# EAGLE design highSpeed_SoC_RS485 (EAGLE 9.6.2)
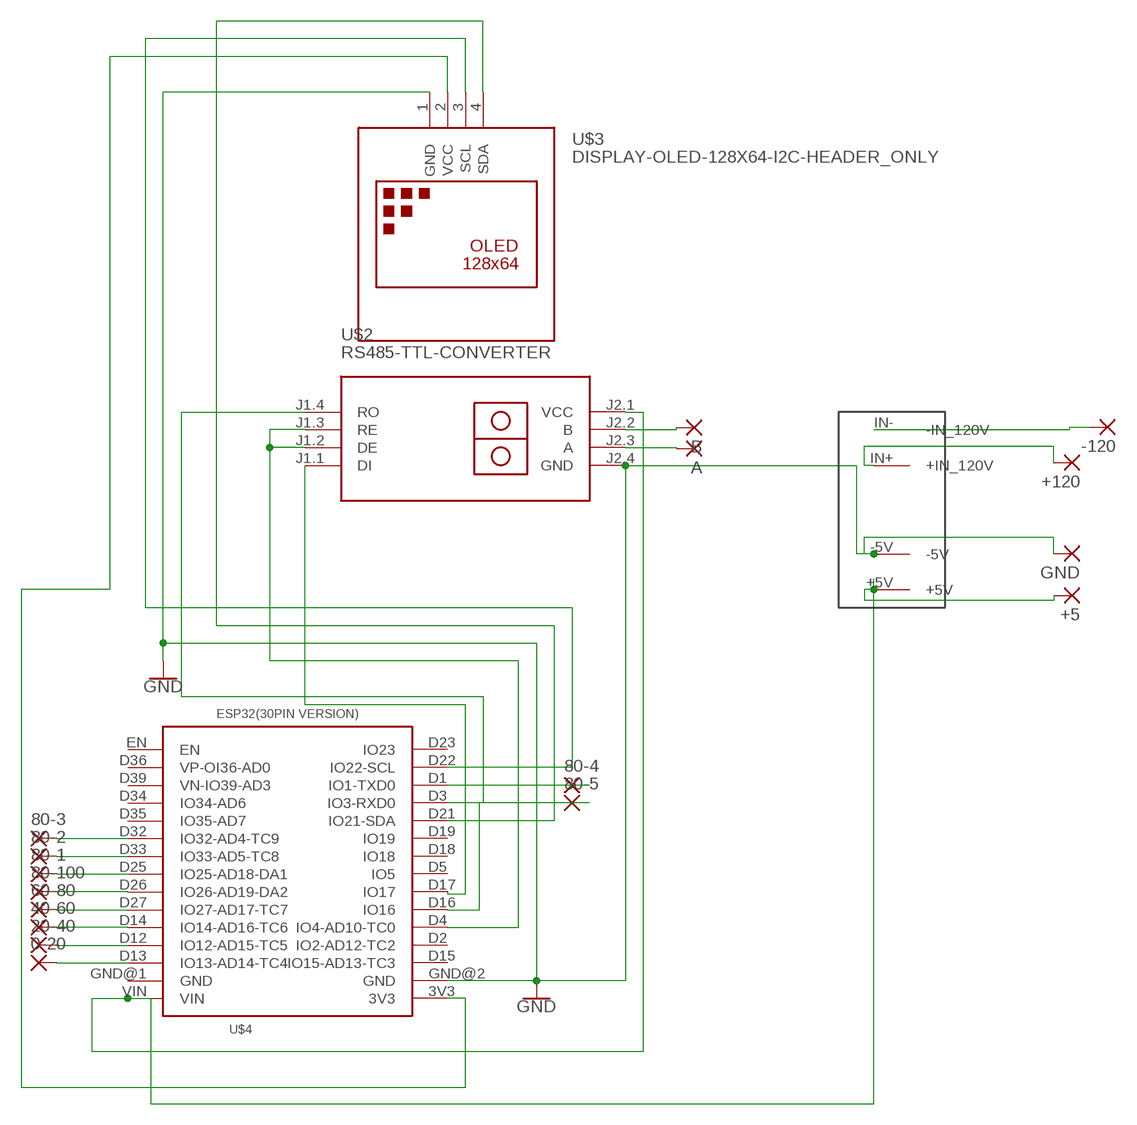
[diagram p0: schematic, sheet 1]

## Parts
0-20  2,54/1,0  [2,54/1,0]
20-40  2,54/1,0  [2,54/1,0]
40-60  2,54/1,0  [2,54/1,0]
60-80  2,54/1,0  [2,54/1,0]
80-1  2,54/1,0  [2,54/1,0]
80-2  2,54/1,0  [2,54/1,0]
80-3  2,54/1,0  [2,54/1,0]
80-4  2,54/1,0  [2,54/1,0]
80-5  2,54/1,0  [2,54/1,0]
80-100  2,54/1,0  [2,54/1,0]
+5  2,54/1,0  [2,54/1,0]
+120  2,54/1,0  [2,54/1,0]
-120  2,54/1,0  [2,54/1,0]
A  2,54/1,0  [2,54/1,0]
B  2,54/1,0  [2,54/1,0]
GND  2,54/1,0  [2,54/1,0]
U$1  DC-DC_CONVERTER_WOLF1  [DC-DC_CONVERTER_WOLF1]
U$2  RS485-TTL-CONVERTER  [RS485-TTL-CONVERTER]
U$3  DISPLAY-OLED-128X64-I2C-HEADER_ONLY  [DISPLAY-OLED-128X64-I2C-HEADER_ONLY]
U$4  ESP32(30PIN_VERSION)  [ESP32(30PIN_VERSION)]

## Nets
GND: GND.1(P) U$1.-5V U$2.J2.4(GND) U$3.1(GND) U$4.GND@2(GND)
N$1: U$3.4(SDA) U$4.D21(IO21-SDA)
N$2: 0-20.1(P) U$4.D13(IO13-AD14-TC4)
N$3: +5.1(P) U$1.+5V U$2.J2.1(VCC) U$4.VIN
N$4: U$2.J1.4(RO) U$4.D16(IO16)
N$5: B.1(P) U$2.J2.2(B)
N$6: U$2.J1.1(DI) U$4.D17(IO17)
N$7: +120.1(P) U$1.IN+(+IN_120V)
N$8: U$3.2(VCC) U$4.3V3
N$9: U$3.3(SCL) U$4.D22(IO22-SCL)
N$10: A.1(P) U$2.J2.3(A)
N$11: -120.1(P) U$1.IN-(-IN_120V)
N$12: 20-40.1(P) U$4.D12(IO12-AD15-TC5)
N$13: U$2.J1.2(DE) U$2.J1.3(RE) U$4.D4(IO4-AD10-TC0)
N$14: 40-60.1(P) U$4.D14(IO14-AD16-TC6)
N$15: 60-80.1(P) U$4.D27(IO27-AD17-TC7)
N$16: 80-100.1(P) U$4.D26(IO26-AD19-DA2)
N$17: 80-1.1(P) U$4.D25(IO25-AD18-DA1)
N$18: 80-2.1(P) U$4.D33(IO33-AD5-TC8)
N$19: 80-3.1(P) U$4.D32(IO32-AD4-TC9)
N$20: 80-4.1(P) U$4.D1(IO1-TXD0)
N$21: 80-5.1(P) U$4.D3(IO3-RXD0)
Unconnected: U$4.D2(IO2-AD12-TC2) U$4.D5(IO5) U$4.D15(IO15-AD13-TC3) U$4.D18(IO18) U$4.D19(IO19) U$4.D23(IO23) U$4.D34(IO34-AD6) U$4.D35(IO35-AD7) U$4.D36(VP-OI36-AD0) U$4.D39(VN-IO39-AD3) U$4.EN U$4.GND@1(GND)

## Library data of the parts
0-20 20-40 40-60 60-80 80-1-80-5 80-100 +5 +120 -120 A B GND = VineetEagleLibrary:2,54/1,0: THROUGH-HOLE PAD
U$1 = VineetEagleLibrary:DC-DC_CONVERTER_WOLF1
U$2 = VineetEagleLibrary:RS485-TTL-CONVERTER: RS485 to TTL converter based on MAX485 chip
U$3 = VineetEagleLibrary:DISPLAY-OLED-128X64-I2C-HEADER_ONLY: OLED Display 128x64 I2C (header only), without the entire footprint of the OLED
U$4 = VineetEagleLibrary:ESP32(30PIN_VERSION): ESP32 DevKit1 30-pin version

## Board
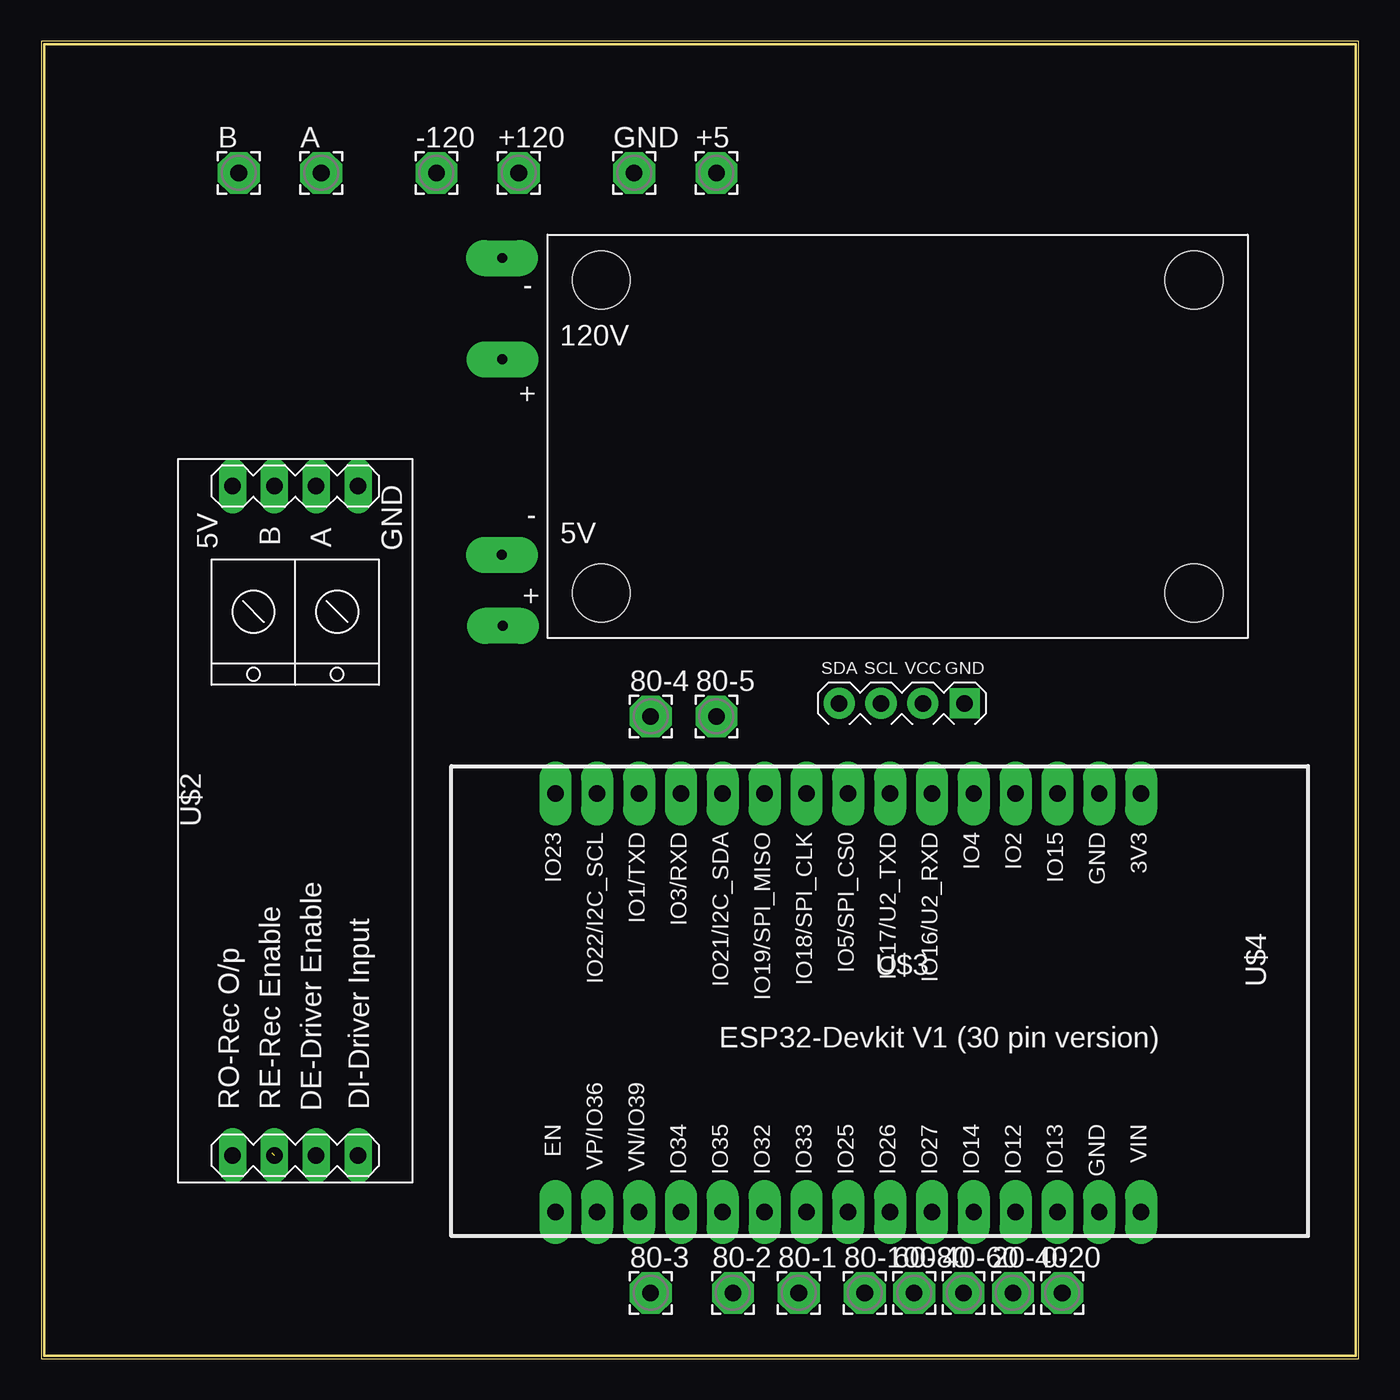
[diagram p1: board, top side]
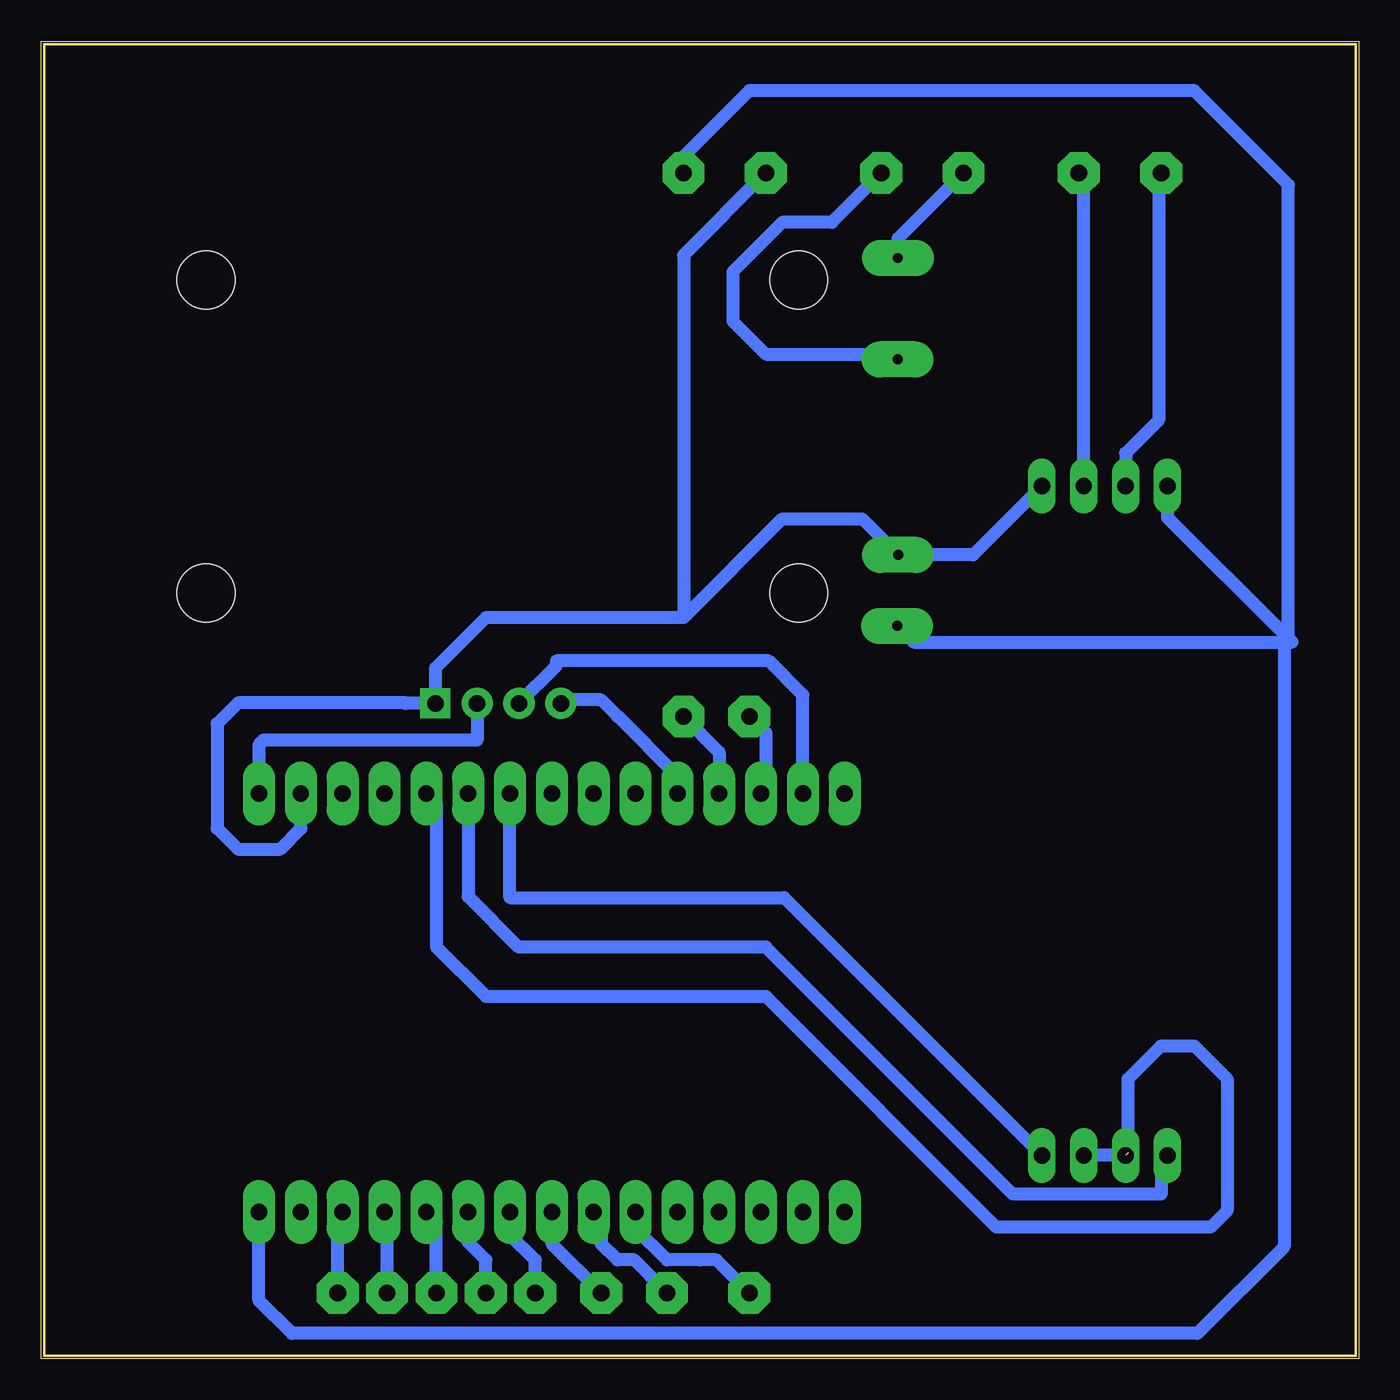
[diagram p2: board, bottom side, seen from below]

Size 80 x 80 mm. Coordinates in mm from the lower left corner, seen from the top.
Outline: 0,80 0,0 80,0 80,80 0,80
Copper layers (1*16): Top 0.035mm / dielectric 1.5mm / Bottom 0.035mm
Design rules "default": minimum track width 6mil, minimum drill 0.35mm, track to track 6mil, track to pad 6mil, pad to pad 6mil, via to via 6mil, smd to smd 6mil, copper to edge 40mil, drill to drill 6mil, minimum pad ring 10mil, minimum via ring 8mil, stop-mask expansion 4mil, vias tented up to drill 0mil, thermal gap 10mil
Milling: 4 lines

### Footprints (pad centres in the part's own frame; a part is rotated, then mirrored left to right if it is on the bottom)
2,54/1,0 = drill 1.016 pad 2.54 octagon: 1 0,0
DC-DC_CONVERTER_WOLF1 = drill 0.6 pad 2.184 long: +5V -23.966,-11.492; -5V -24.031,-7.182; IN+ -24.003,4.684; IN- -24.012,10.833 | hole 3.5: -18,9.5; 18,9.5; 18,-9.5; -18,-9.5
RS485-TTL-CONVERTER = drill 1 pad 1.676 long: J1.1 -20.32,-3.81; J1.2 -20.32,-1.27; J1.3 -20.32,1.27; J1.4 -20.32,3.81; J2.1 20.32,3.81; J2.2 20.32,1.27; J2.3 20.32,-1.27; J2.4 20.32,-3.81
DISPLAY-OLED-128X64-I2C-HEADER_ONLY = drill 1 pad 1.8 square: 1 -3.81,0 | drill 1 pad 1.9: 2 -1.27,0; 3 1.27,0; 4 3.81,0
ESP32(30PIN_VERSION) = drill 1 pad 1.93 long: 3V3 -16.52,-12.27; D1 13.96,-12.27; D2 -8.9,-12.27; D3 11.42,-12.27; D4 -6.36,-12.27; D5 1.26,-12.27; D12 -8.9,13.135; D13 -11.44,13.135; D14 -6.36,13.135; D15 -11.44,-12.27; D16 -3.82,-12.27; D17 -1.28,-12.27; D18 3.8,-12.27; D19 6.34,-12.27; D21 8.88,-12.27; D22 16.5,-12.27; D23 19.04,-12.27; D25 1.26,13.135; D26 -1.28,13.135; D27 -3.82,13.135; D32 6.34,13.135; D33 3.8,13.135; D34 11.42,13.135; D35 8.88,13.135; D36 16.5,13.135; D39 13.96,13.135; EN 19.04,13.135; GND@1 -13.98,13.135; GND@2 -13.98,-12.27; VIN -16.52,13.135

### Placement (x,y rotation side)
0-20  62,4 0 top
20-40  59,4 0 top
40-60  56,4 0 top
60-80  53,4 0 top
80-1  46,4 0 top
80-2  42,4 0 top
80-3  37,4 0 top
80-4  37,39 0 top
80-5  41,39 0 top
80-100  50,4 0 top
+5  41,72 0 top
+120  29,72 0 top
-120  24,72 0 top
A  17,72 0 top
B  12,72 0 top
GND  36,72 0 top
U$1  52,56 0 top
U$2  15.43,32.67 90 top
U$3  52.26,39.8 180 top
U$4  50.26,22.05 180 top

### Tracks (layer width: path | path; a pad name or v marks a point on that pad's centre or on a via)
GND
  Bottom 0.152: U$4.GND@2
  Bottom 0.8: U$4.GND@2 64.23,32.21 65.5,30.94 68.04,30.94 69.31,32.21 69.31,38.56 68.04,39.83 57.88,39.83 57.87,39.8 U$3.1 56.07,41.93 53,45 41,45 | 41,45 35,51 30.15,51 U$1.-5V 23.41,48.82 U$2.J2.4 | GND.1 41,67 41,45
N$1
  Bottom 0.152: U$4.D21 | 45,39 45.4,39.4
  Bottom 0.8: U$4.D21 41.38,35.38 45,39 46,40 48.25,40 U$3.4
N$2
  Bottom 0.8: U$4.D13 62,8.62 0-20.1
N$3
  Bottom 0.152: U$4.VIN 66.86,9
  Bottom 0.8: U$2.J2.1 11.62,51.08 4.54,44 | 4.54,44 4.27,43.73 | 4.27,43.73 4.05,43.51 27.03,43.51 U$1.+5V | U$4.VIN 66.78,3.55 64.77,1.54 9.81,1.54 4.54,6.81 4.54,44 | 4.27,43.73 4.27,71.27 10,77 37,77 41,73 +5.1
N$4
  Bottom 0.152: U$2.J1.4 12,11.97
  Bottom 0.8: 12,11.97 12,10 21,10 36,25 51,25 54.08,28.08 U$4.D16
N$5
  Bottom 0.8: B.1 12.16,71.84 12.16,56.99 14.16,54.99 U$2.J2.2
N$6
  Bottom 0.8: U$2.J1.1 34.89,28 51.54,28 U$4.D17
N$7
  Bottom 0.8: +120.1 32,69 35,69 38,66 38,63 36,61 28.31,61 U$1.IN+
N$8
  Bottom 0.8: U$3.2 53.53,37.56 66.5,37.56 66.78,37.28 U$4.3V3
N$9
  Bottom 0.152: U$4.D22
  Bottom 0.8: U$4.D22 33.75,40.29 35.83,42.37 48.7,42.37 48.74,42.05 U$3.3
N$10
  Bottom 0.152: 16.7,71.7 A.1
  Bottom 0.8: U$2.J2.3 16.7,71.7
N$11
  Bottom 0.8: -120.1 27.99,68.01 U$1.IN-
N$12
  Bottom 0.8: 20-40.1 59,8.76 U$4.D12
N$13  (1 unrouted)
  Bottom 0.8: 14,12.51 14,17 12,19 10,19 8,17 8,9 9,8 22,8 36,22 53,22 56,25 56,33.7 U$4.D4 | U$2.J1.3 U$2.J1.2
N$14
  Bottom 0.8: U$4.D14 56,8.29 40-60.1
N$15
  Bottom 0.8: 60-80.1 53,6 54.08,7.08 U$4.D27
N$16
  Bottom 0.8: 80-100.1 50,6 51.54,7.54 U$4.D26
N$17
  Bottom 0.8: U$4.D25 49,7 80-1.1
N$18
  Bottom 0.8: U$4.D33 46.46,8.46 46,8 46,7 45,6 44,6 43,5 80-2.1
N$19
  Bottom 0.8: U$4.D32 43.92,7.92 42,6 40,6 39,6 80-3.1
N$20
  Bottom 0.8: U$4.D1 36,34.62 36,38 80-4.1
N$21
  Bottom 0.8: U$4.D3 38.84,36.84 80-5.1